# EasyEDA Pro project RackEth_rev_1.eprj

# Schematic RackEth
Board Name: RackEth; Create Date: 2024-12-09; Page Name: RackEth; Project Name: RackEth.pre_usb_fix; Schematic Name: RackEth; Update Date: 2025-01-19; Company: EasyEDA.com; Drawn: EasyEDA; Page Size: A4; Part Number: JLCPCB-002; Reviewed: EasyEDA; Version: V0.1
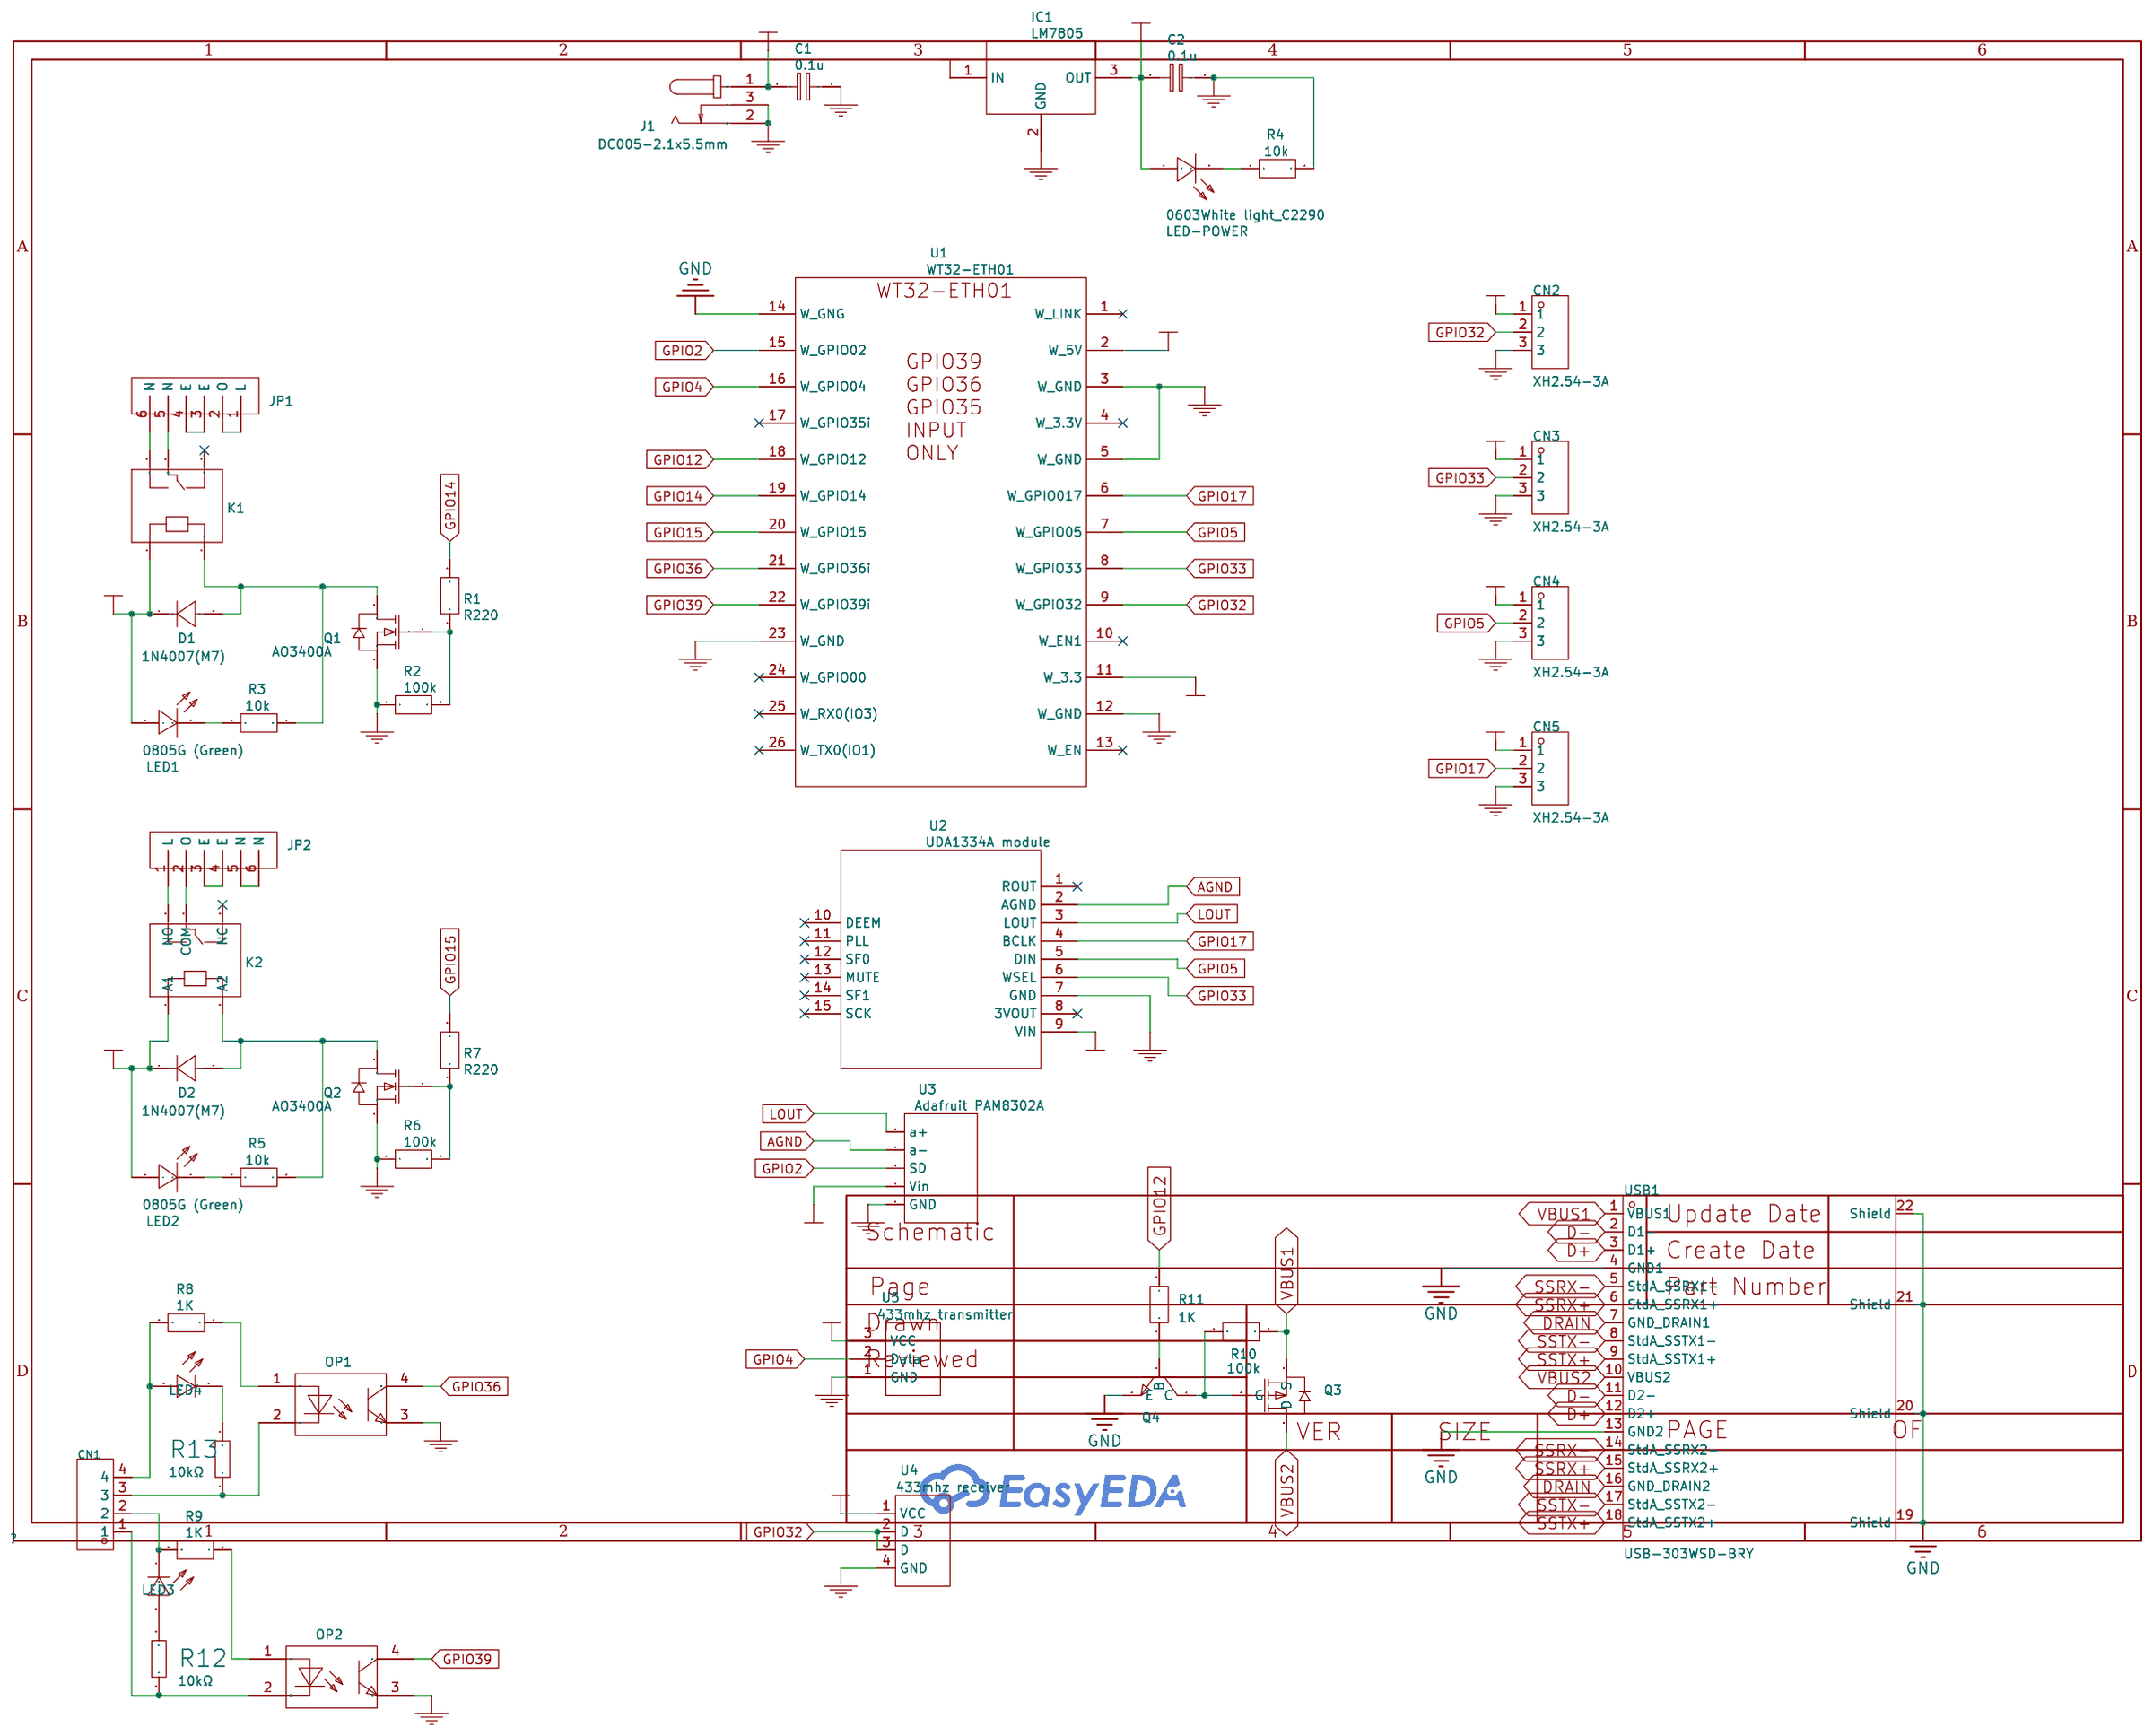
[diagram p0: schematic sheet]

## Parts
C1  0.1u  [C0603]
C2  0.1u  [C0603]
CN1  WJ127-5.0-4P  [CONN-TH_4P-P5.00_WJ127-5.0-4P]  (no BOM)
CN2  XH2.54-3A  [CONN-TH_3P-P2.50_HCTL_XH-3A-L]  (no BOM)
CN3  XH2.54-3A  [CONN-TH_3P-P2.50_HCTL_XH-3A-L]  (no BOM)
CN4  XH2.54-3A  [CONN-TH_3P-P2.50_HCTL_XH-3A-L]  (no BOM)
CN5  XH2.54-3A  [CONN-TH_3P-P2.50_HCTL_XH-3A-L]  (no BOM)
D1  1N4007(M7)  [SMA_L4.3-W2.7-LS5.1-RD]
D2  1N4007(M7)  [SMA_L4.3-W2.7-LS5.1-RD]
IC1  LM7805  [LM7805]  (no BOM)
J1  DC005-2.1x5.5mm  [DC-IN-TH_POWER-JACK]  (no BOM)
JP1  JP1  [CONN-TH_6P-P5.00_WJ127-5.0-6P]  (no BOM)
JP2  JP2  [CONN-TH_6P-P5.00_WJ127-5.0-6P]  (no BOM)
K1  Relay1  [SRD-05VDC-SL-C_RELAY_SRD-05VDC-SL-C]  (no BOM)
K2  Relay2  [SRD-05VDC-SL-C_RELAY_SRD-05VDC-SL-C]  (no BOM)
LED1  0805G (Green)  [LED0805-RD_GREEN]
LED2  0805G (Green)  [LED0805-RD_GREEN]
LED3  19-213/Y2C-CQ2R2L/3T(CY)  [LED0603-RD-YELLOW]
LED4  19-213/Y2C-CQ2R2L/3T(CY)  [LED0603-RD-YELLOW]
LED-POWER  0603White light_C2290  [LED0603-R-RD_WHITE]
OP1  EL817S1(C)(TU)-F  [OPTO-SMD-4_L4.6-W6.5-P2.54-LS10.3-TL]
OP2  EL817S1(C)(TU)-F  [OPTO-SMD-4_L4.6-W6.5-P2.54-LS10.3-TL]
Q1  AO3400A  [SOT-23-3_L2.9-W1.6-P1.90-LS2.8-BR]
Q2  AO3400A  [SOT-23-3_L2.9-W1.6-P1.90-LS2.8-BR]
Q3  AO3401A  [SOT-23_L2.9-W1.3-P1.90-LS2.4-BR]
Q4  MMBT3904(RANGE:100-300)  [SOT-23-3_L2.9-W1.3-P1.90-LS2.4-BR]
R1  R220  [R0603]
R2  100k  [R0603]
R3  10k  [R0603]
R4  10k  [R0603]
R5  10k  [R0603]
R6  100k  [R0603]
R7  R220  [R0603]
R8  1K  [R0603]
R9  1K  [R0603]
R10  100k  [R0603]
R11  1K  [R0603]
R12  10kΩ  [R0603]
R13  10kΩ  [R0603]
U1  WT32-ETH01  [WT32-ETH01-M]  (no BOM)
U2  UDA1334A module  [UDA1334A_MODULE]  (no BOM)
U3  Adafruit PAM8302A  [ADAFRUIT PAM8302A]  (no BOM)
U4  433mhz receiver  [433MHZ-RECEIVER-PINS]  (no BOM)
U5  433mhz transmitter  [RF-TRANSMITTER (433MHZ)]  (no BOM)
USB1  USB-303WSD-BRY  [USB-A-TH_XUNPU_USB-303WSD-BRY]  (no BOM)

## Library data of the parts
C1 C2 = 0.1u: Supplier Part: C1525; Supplier: LCSC; Manufacturer Part: CL05B104KO5NNNC; Manufacturer: SAMSUNG(三星)
CN1 = WJ127-5.0-4P: LCSC Part Name: 5mm 1x4P 排数:1 每排P数:4 直插; Supplier Part: C192779; Manufacturer: KANGNEX(康奈克斯电气); Supplier Footprint: 插件,P=5mm; JLCPCB Part Class: Extended Part; Datasheet: https://atta.szlcsc.com/upload/public/pdf/source/20191225/C192779_DBD79F61C9FABD31EC3EFBBD98D95251.pdf; Supplier: LCSC; Structure: 1x4P; Pitch: 5mm; Color: Green; Mounting Style: Straight; Current Rating (Max): 15A; Voltage Rating (Max): 250V; Number of Pins: 4P; Number of Rows: 1; Wire Gauge - AWG: 14~26; Wire Gauge - mm2: 1.5; Number of PINs Per Row: 4; Operating Temperature Range: -40℃~+105℃
CN2-CN5 = XH2.54-3A: Supplier Part: C9900018379; Supplier: LCSC
D1 D2 = 1N4007(M7): Supplier: LCSC; Supplier Part: C2988638; Manufacturer: UMW(友台半导体); JLCPCB Part Class: Extended Part
IC1 = LM7805: sim: true
J1 = DC005-2.1x5.5mm: Supplier: LCSC; Supplier Part: C9900001795; Manufacturer: 索峰; Manufacturer Part: POWER-JACK; JLCPCB Part Class: Extended Part
JP1 JP2 = Terminal?: Supplier Part: 6P Terminal Block Connector 5.0mm; Supplier: Amazon; link: https://www.amazon.com/gp/product/B00NWEC8TW
K1 = Relay1: Supplier Part: SRD-05VDC-SL-C_SRD-05VDC-SL-C
K2 = Relay2: Supplier Part: SRD-05VDC-SL-C_SRD-05VDC-SL-C
LED1 LED2 = 0805G (Green): Supplier: LCSC; Manufacturer: KENTO; Supplier Part: C2297; JLCPCB Part Class: Basic Part
LED3 LED4 = 19-213/Y2C-CQ2R2L/3T(CY): LCSC Part Name: 黄灯; Supplier Part: C72038; Manufacturer: EVERLIGHT(亿光); Supplier Footprint: 0603; JLCPCB Part Class: Basic Part; Datasheet: https://atta.szlcsc.com/upload/public/pdf/source/20160507/1462613613586.pdf; Supplier: LCSC; Emitted Color: Yellow; Power Dissipation: 60mW; Forward Current: 20mA; Dominant Wavelength: 585.5nm~591.5nm; Peak Wavelength: 591nm; Lens Color: 无色透明透镜; Viewing Angle: 120°; Operating Temperature: -40℃~+85℃
LED-POWER = 0603White light_C2290: Supplier: LCSC; Manufacturer: KENTO; Manufacturer Part: KT-0603W; Supplier Part: C2290; JLCPCB Part Class: Basic Part
OP1 OP2 = EL817S1(C)(TU)-F: Supplier: LCSC; Manufacturer: EVERLIGHT(亿光); Supplier Part: C106900; JLCPCB Part Class: Basic Part
Q1 Q2 = AO3400A: Supplier: LCSC; Manufacturer: AOS; Supplier Part: C20917; JLCPCB Part Class: Basic Part
Q3 = AO3401A_C15127: Type:1 Piece P-Channel Drain Source Voltage (Vdss): Continuous Drain Current (Id): Drain Source On Resistance (RDS(on)@Vgs,Id):44mΩ@10V,4.3A Power Dissipation (Pd): Gate Threshold Voltage (Vgs(th)@Id):1.3V@250uA Total Gate Charge (Qg@Vgs):12.2nC@4.5V Inpu; LCSC Part Name: 1个P沟道 耐压:30V 电流:4A; Supplier Part: C15127; Manufacturer: AOS; Supplier Footprint: SOT-23; JLCPCB Part Class: Basic Part; Datasheet: https://atta.szlcsc.com/upload/public/pdf/source/20160507/1462613609053.pdf; Supplier: LCSC; Type: 1 Piece P-Channel; Drain Source On Resistance (RDS(on)@Vgs,Id): 44mΩ@10V,4.3A; Gate Threshold Voltage (Vgs(th)@Id): 1.3V@250uA; Total Gate Charge (Qg@Vgs): 12.2nC@4.5V; Input Capacitance (Ciss@Vds): 1.2nF@15V; Operating Temperature: -55℃~+150℃@(Tj)
Q4 = MMBT3904(RANGE:100-300): Transistor Type: Collector Current (Ic): Collector-Emitter Breakdown Voltage (Vceo): Power Dissipation (Pd): DC Current Gain (hFE@Ic,Vce):100@10mA,1V DC Current Gain (hFE@Ic,Vce):100@10mA,1V Transition Frequency (fT):300MHz Collector Cut-Off Current (Icbo; LCSC Part Name: NPN 电流:200mA 耐压:40V hfe=100~300; Supplier Part: C20526; Manufacturer: CJ(江苏长电/长晶); Supplier Footprint: SOT-23; JLCPCB Part Class: Basic Part; Datasheet: https://atta.szlcsc.com/upload/public/pdf/source/20220704/70F575FB75061E03F919270A6BB8BA7F.pdf; Supplier: LCSC; DC Current Gain (hFE@Ic,Vce): 100@10mA,1V; Transition Frequency (fT): 300MHz; Collector Cut-Off Current (Icbo): 100nA; Collector-Emitter Saturation Voltage (VCE(sat)@Ic,Ib): 300mV@50mA,5mA
R1 R7 = R220: Supplier Part: C22962; Supplier: LCSC; Manufacturer Part: 0603WAF2200T5E; Manufacturer: UNI-ROYAL(厚声)
R2 R6 R10 = 100k: Supplier Part: C25803; Supplier: LCSC; Manufacturer Part: 0603WAF1003T5E; Manufacturer: UNI-ROYAL(厚声)
R3-R5 = 10k: Supplier Part: C25804; Supplier: LCSC; Manufacturer Part: 0603WAF1002T5E; Manufacturer: UNI-ROYAL(厚声)
R8 R9 R11 = 1K: Supplier Part: C22962; Supplier: LCSC; Manufacturer Part: 0603WAF2200T5E; Manufacturer: UNI-ROYAL(厚声)
R12 R13 = 0603WAF1002T5E: LCSC Part Name: 厚膜电阻 10kΩ ±1% 100mW; Supplier Part: C25804; Manufacturer: UNI-ROYAL(厚声); Supplier Footprint: 0603; JLCPCB Part Class: Basic Part; Datasheet: https://atta.szlcsc.com/upload/public/pdf/source/20200306/C422600_1E6D84923E4A46A82E41ADD87F860B5C.pdf; Supplier: LCSC; Type: Thick Film Resistors; Tolerance: ±1%; Temperature Coefficient: ±100ppm/℃; Operating Temperature Range: -55℃~+155℃
U1 = WT32-ETH01: Manufacturer: Wireless-Tag; link: http://www.wireless-tag.com/wp-content/uploads/2020/08/WT32-ETH01规格书V1.2EN（英文）.pdf
U2 = UDA1334A module
U3 = Adafruit PAM8302A
U4 = 433mhz receiver
U5 = 433mhz transmitter
USB1 = USB-303WSD-BRY: LCSC Part Name: Type-A 母 弯插; Supplier Part: C2895028; Manufacturer: XUNPU(讯普); Supplier Footprint: 插件; JLCPCB Part Class: Extended Part; Datasheet: https://atta.szlcsc.com/upload/public/pdf/source/20230426/A73C665BA3413059F595E5846F1512B5.pdf; Supplier: LCSC; Connector Type: Type-A; Standard: USB 3.0; Gender: Female; Mounting Style: Bend insert; Number of Contacts: 9Px2; Number of Ports: 2; Current Rating - Power (Max): 1.8A; Operating Temperature Range: -30℃~+85℃

## Nets
+3.3V: CN2.1 CN3.1 CN4.1 CN5.1 U1.11(W_3.3)
+5V: C2.1 D1.1(K) D2.1(K) IC1.3(OUT) K1.A1 K2.A1 LED1.2(A) LED2.2(A) LED-POWER.1(A) U1.2(W_5V) U2.9(VIN) U3.4(Vin) U4.1(VCC) U5.3(VCC)
AGND: U2.2(AGND) U3.2(a-)
GND: C1.2 C2.2 CN2.3 CN3.3 CN4.3 CN5.3 IC1.2(GND) J1.2(GND) J1.3 OP1.3(EM) OP2.3(EM) Q1.2(S) Q2.2(S) Q4.2(E) R2.1 R4.2 R6.1 U1.3(W_GND) U1.5(W_GND) U1.12(W_GND) U1.14(W_GNG) U1.23(W_GND) U2.7(GND) U3.5(GND) U4.4(GND) U5.1(GND) USB1.4(GND1) USB1.13(GND2) USB1.19(Shield) USB1.20(Shield) USB1.21(Shield) USB1.22(Shield)
VBUS1: Q3.2(S) R10.2 USB1.1(VBUS1)
VBUS2: Q3.3(D) USB1.10(VBUS2)
VCC: C1.1 IC1.1(IN) J1.1(VCC)
D+: USB1.3(D1+) USB1.12(D2+)
D-: USB1.2(D1-) USB1.11(D2-)
DRAIN: USB1.7(GND_DRAIN1) USB1.16(GND_DRAIN2)
GPIO2: U1.15(W_GPIO02) U3.3(SD)
GPIO4: U1.16(W_GPIO04) U5.2(Data)
GPIO5: CN4.2 U1.7(W_GPIO05) U2.5(DIN)
GPIO12: R11.2 U1.18(W_GPIO12)
GPIO14: R1.2 U1.19(W_GPIO14)
GPIO15: R7.2 U1.20(W_GPIO15)
GPIO17: CN5.2 U1.6(W_GPIO017) U2.4(BCLK)
GPIO32: CN2.2 U1.9(W_GPIO32) U4.2(D) U4.3(D)
GPIO33: CN3.2 U1.8(W_GPIO33) U2.6(WSEL)
GPIO36: OP1.4(COL) U1.21(W_GPIO36i)
GPIO39: OP2.4(COL) U1.22(W_GPIO39i)
LOUT: U2.3(LOUT) U3.1(a+)
SSRX+: USB1.6(StdA_SSRX1+) USB1.15(StdA_SSRX2+)
SSRX-: USB1.5(StdA_SSRX1-) USB1.14(StdA_SSRX2-)
SSTX+: USB1.9(StdA_SSTX1+) USB1.18(StdA_SSTX2+)
SSTX-: USB1.8(StdA_SSTX1-) USB1.17(StdA_SSTX2-)
$1N3: D1.2(A) K1.A2 Q1.3(D) R3.2
$1N5: Q1.1(G) R1.1 R2.2
$1N15: LED1.1(K) R3.1
$1N16: LED-POWER.2(K) R4.1
$1N18: D2.2(A) K2.A2 Q2.3(D) R5.2
$1N19: LED2.1(K) R5.1
$1N25: Q2.1(G) R6.2 R7.1
$1N58: OP1.1(AN) R8.1
$1N59: CN1.4 LED4.2(A) R8.2
$1N60: CN1.2 LED3.1(C) R9.2
$1N61: OP2.1(AN) R9.1
$1N4552: JP2.3(E) JP2.4(E)
$1N4588: JP1.6(N) K1.NO
$1N4592: JP1.5(N) K1.COM
$1N4597: JP1.3(E) JP1.4(E)
$1N4602: JP1.1(L) JP1.2(O)
$1N4658: JP2.2(O) K2.COM
$1N4661: JP2.1(L) K2.NO
$1N4663: JP2.5(N) JP2.6(N)
$1N8054: Q4.1(B) R11.1
$1N8058: Q3.1(G) Q4.3(C) R10.1
$1N12669: CN1.3 OP1.2(CAT) R13.1
$1N12679: CN1.1 OP2.2(CAT) R12.1
$1N14685: LED4.1(C) R13.2
$1N14687: LED3.2(A) R12.2

Not connected (* = marked no-connect by the designer): K1 NC*; K2 NC*; U1 1(W_LINK)* 4(W_3.3V)* 10(W_EN1)* 13(W_EN)* 17(W_GPIO35i)* 24(W_GPIO00)* 25(W_RX0(IO3))* 26(W_TX0(IO1))*; U2 1(ROUT)* 8(3VOUT)* 10(DEEM)* 11(PLL)* 12(SF0)* 13(MUTE)* 14(SF1)* 15(SCK)*

# Board RackEth
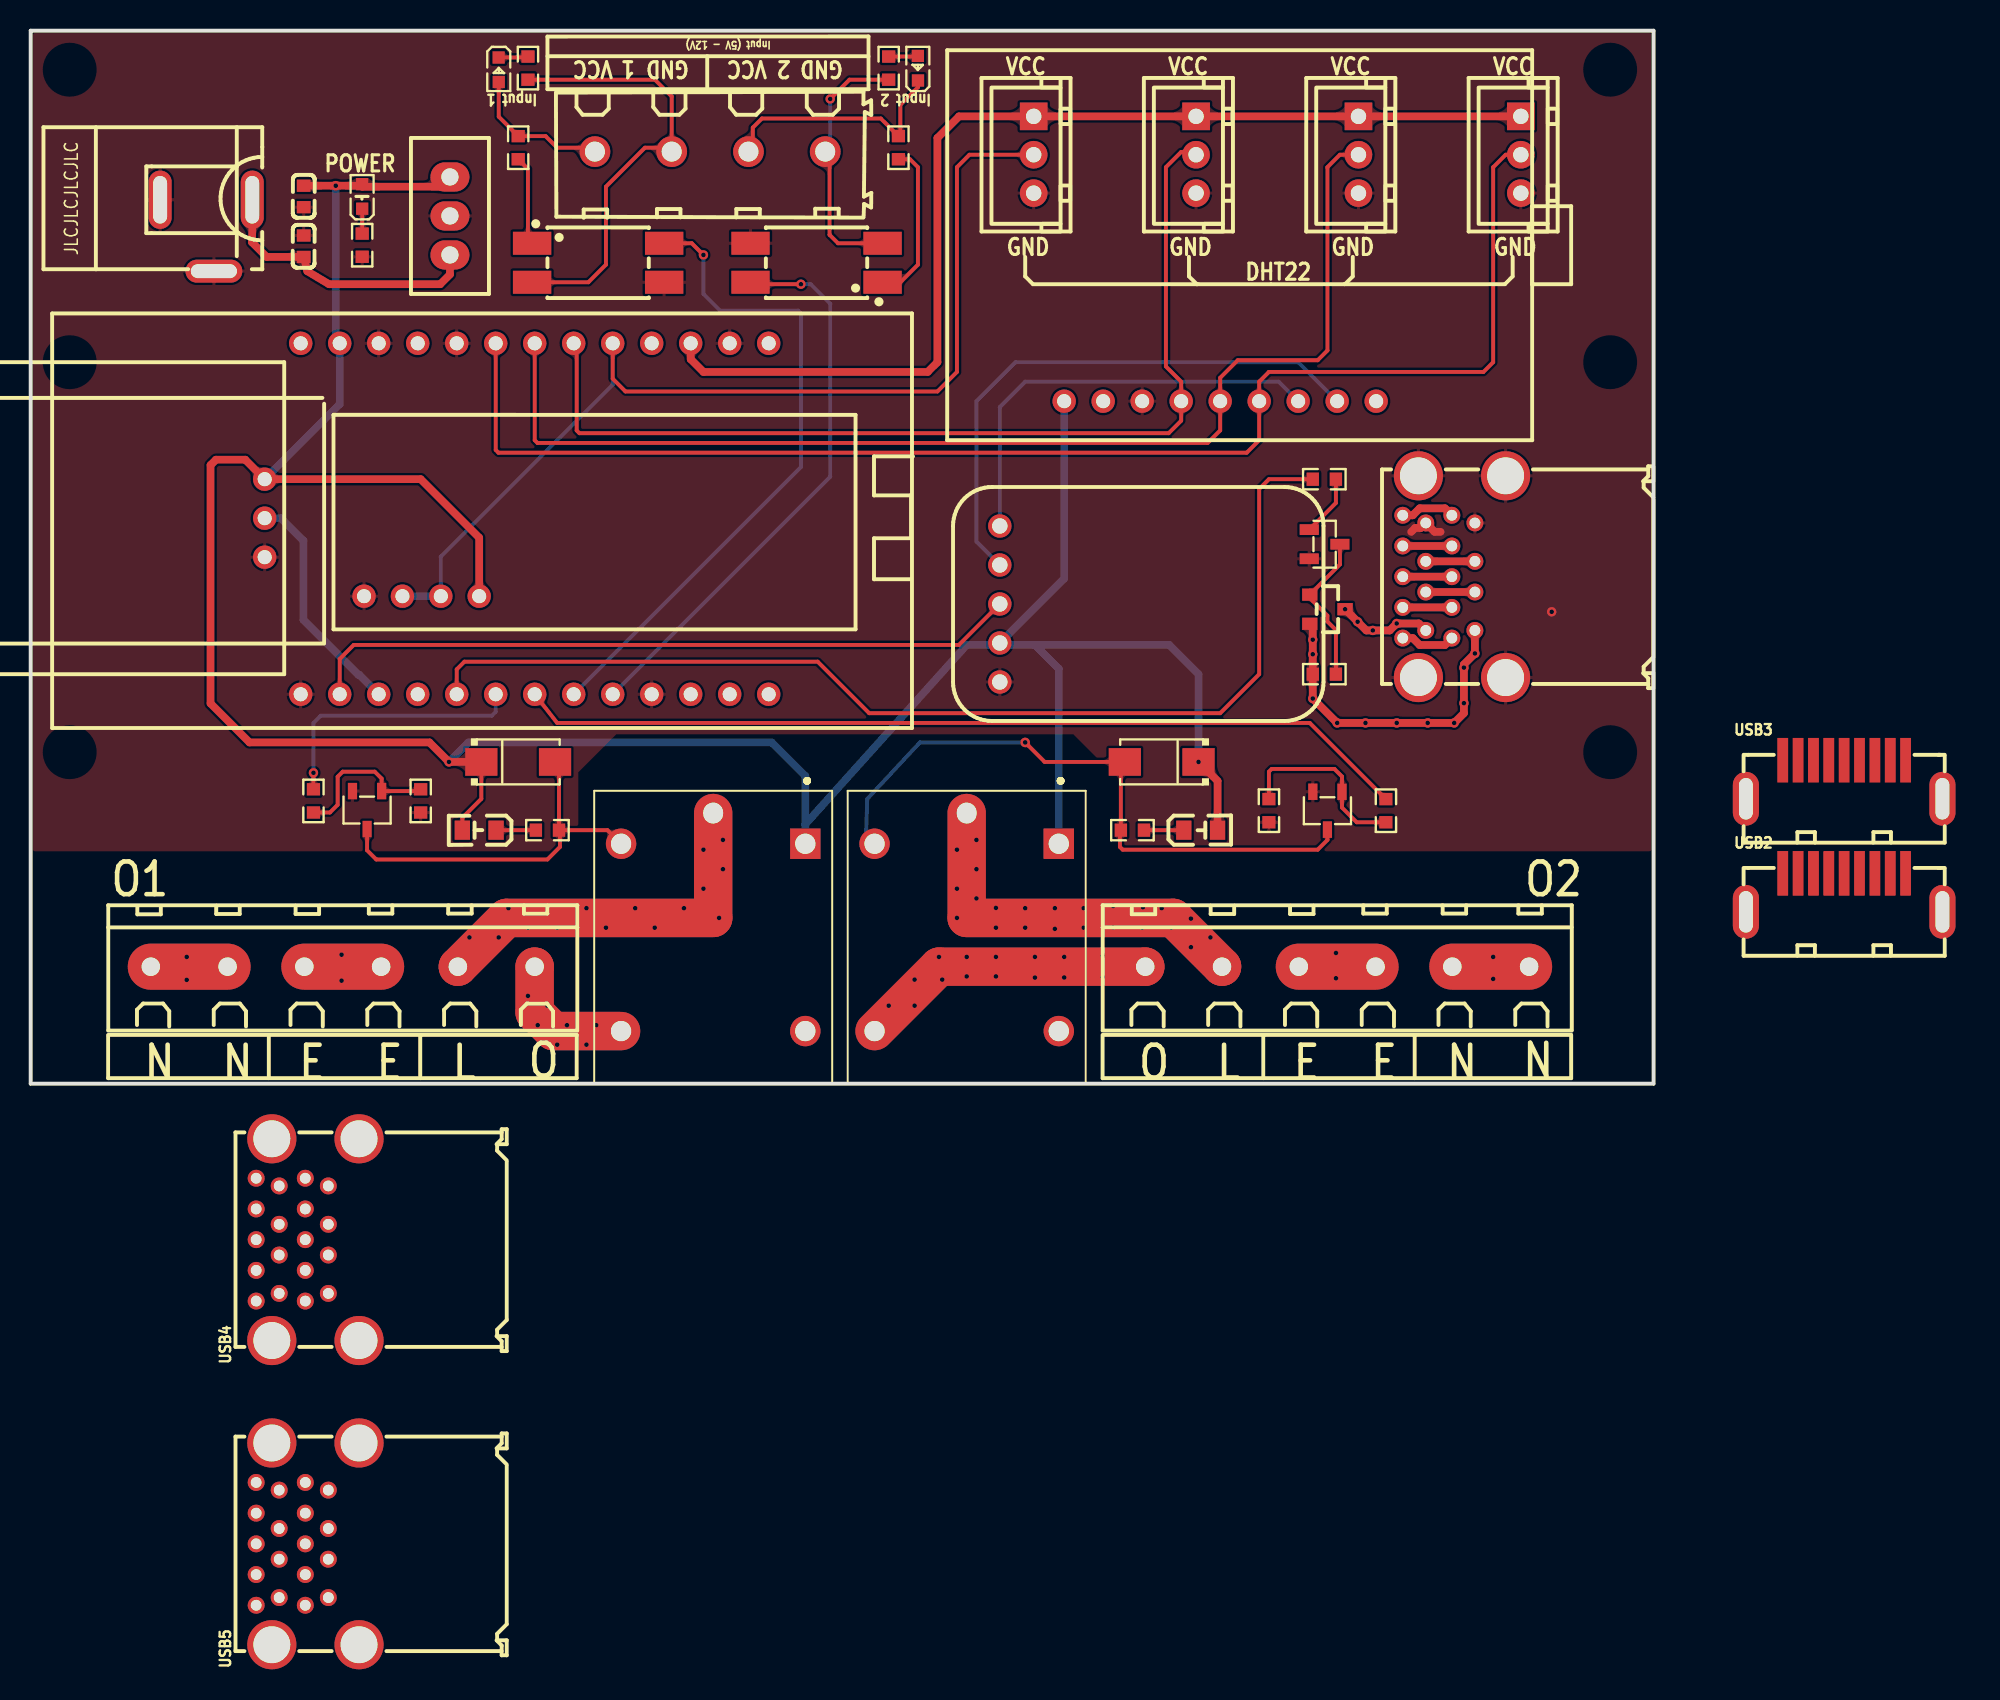
[diagram p1: board, top side]
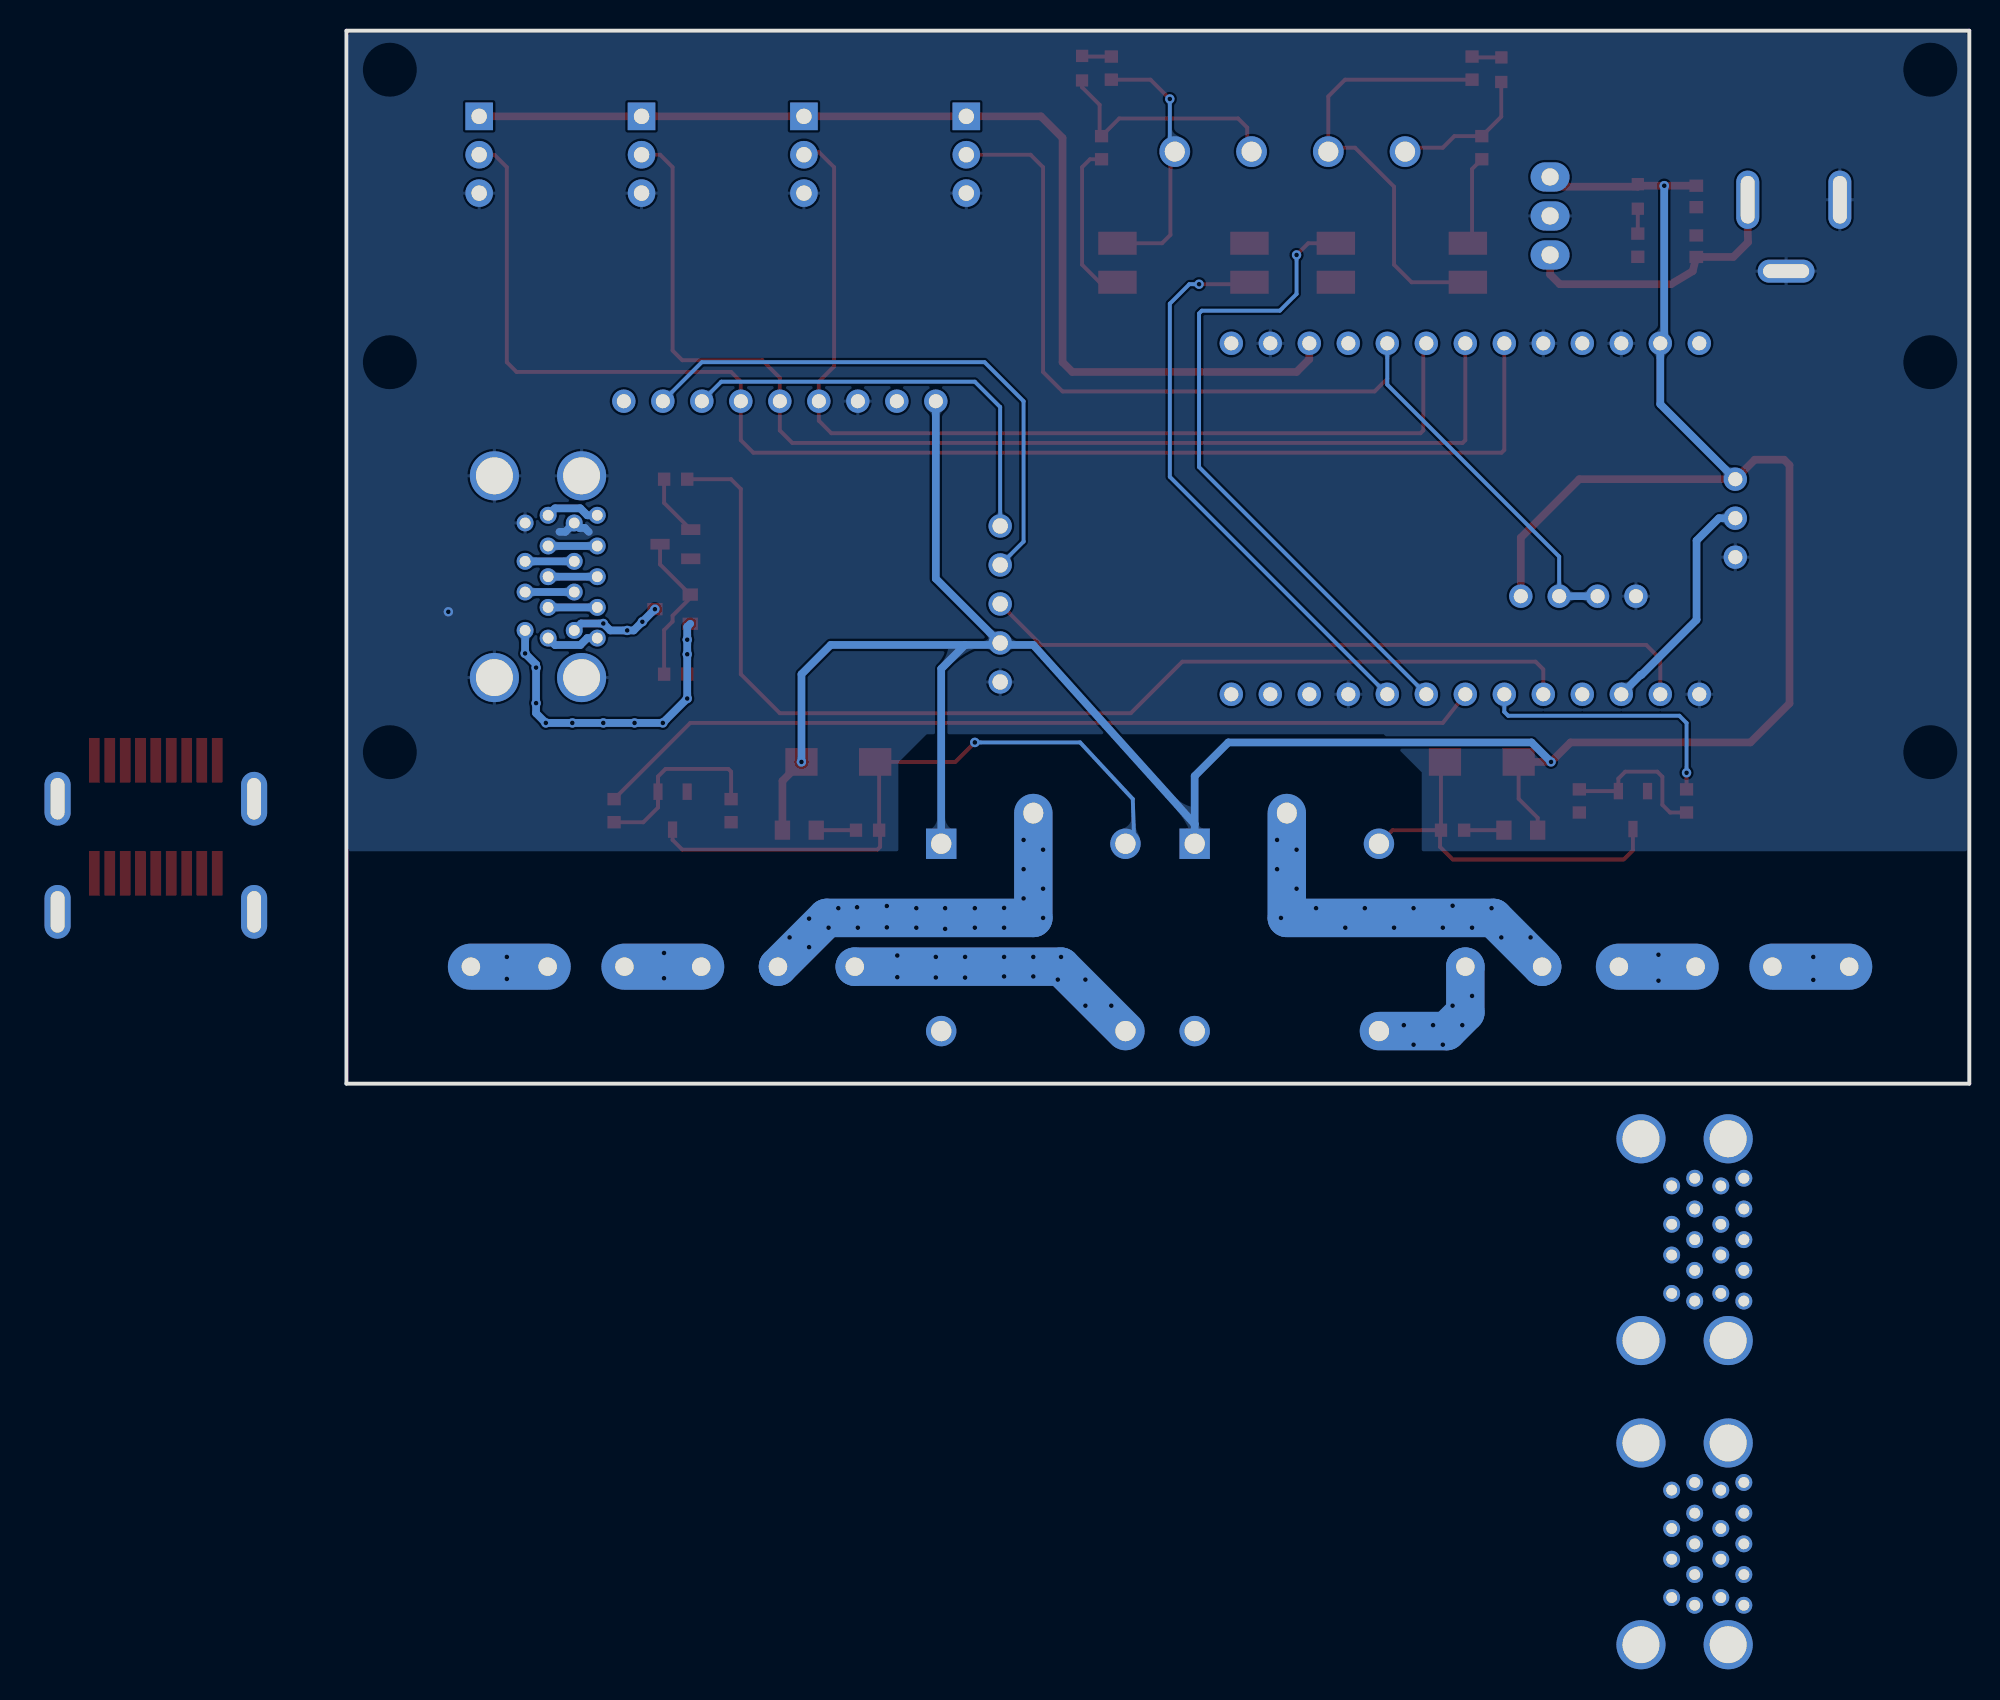
[diagram p2: board, bottom side, seen from below]

Outline 105.7 x 68.58 mm; copper layers: Top Layer, Bottom Layer. Coordinates in mm from the lower left corner of the outline.
Outline path: 0,68.58 105.7,68.58 105.7,0 0,0 0,68.58
Stack: Top Layer 0.035mm / Dielectric1 1.51mm FR4 er 4.5 / Bottom Layer 0.035mm

## Design rules (mm)
spacing Default (default): track to track 0.152, other pairs 0 to 0.152
track width Default (default): min 0.254, default 0.254, max 25.4
differential pair differentialPair (default): width min 0.127, default 0.254, max 2.54; gap min 0.152, default 0.152
via Default (default): diameter min 0.61, default 0.61, max 100.025; hole min 0.305, default 0.305, max 59.995
pour e157 uses gge16239
pour e214 uses gge16239(1)

## Placement (name value [footprint] x y rotation side)
C1  0.1u  [C0603]  17.78 54.55 90 top
C2  0.1u  [C0603]  17.78 57.78 270 top
CN1  WJ127-5.0-4P  [CONN-TH_4P-P5.00_WJ127-5.0-4P]  44.25 60.71 180 top
CN2  XH2.54-3A  [CONN-TH_3P-P2.50_HCTL_XH-3A-L]  65.32 60.5 90 top
CN3  XH2.54-3A  [CONN-TH_3P-P2.50_HCTL_XH-3A-L]  75.9 60.5 90 top
CN4  XH2.54-3A  [CONN-TH_3P-P2.50_HCTL_XH-3A-L]  86.48 60.5 90 top
CN5  XH2.54-3A  [CONN-TH_3P-P2.50_HCTL_XH-3A-L]  97.05 60.5 90 top
D1  1N4007(M7)  [SMA_L4.3-W2.7-LS5.1-RD]  31.75 20.95 0 top
D2  1N4007(M7)  [SMA_L4.3-W2.7-LS5.1-RD]  73.66 20.95 180 top
IC1  -  [LM7805]  27.31 56.52 90 top
J1  DC005-2.1x5.5mm  [DC-IN-TH_POWER-JACK]  11.43 55.25 0 top
JP1  JP1  [CONN-TH_6P-P5.00_WJ127-5.0-6P]  20.32 7.62 0 top
JP2  JP2  [CONN-TH_6P-P5.00_WJ127-5.0-6P]  85.09 7.62 0 top
K1  Relay1  [SRD-05VDC-SL-C_RELAY_SRD-05VDC-SL-C]  44.45 9.53 270 top
K2  Relay2  [SRD-05VDC-SL-C_RELAY_SRD-05VDC-SL-C]  60.96 9.53 270 top
LED1  0805G (Green)  [LED0805-RD_GREEN]  29.21 16.51 0 top
LED2  0805G (Green)  [LED0805-RD_GREEN]  76.2 16.51 180 top
LED3  19-213/Y2C-CQ2R2L/3T(CY)  [LED0603-RD-YELLOW]  57.78 66.14 90 top
LED4  19-213/Y2C-CQ2R2L/3T(CY)  [LED0603-RD-YELLOW]  30.48 66.04 270 top
LED-POWER  0603White light_C2290  [LED0603-R-RD_WHITE]  21.59 57.78 90 top
OP1  EL817S1(C)(TU)-F  [OPTO-SMD-4_L4.6-W6.5-P2.54-LS10.3-TL]  36.96 53.47 0 top
OP2  EL817S1(C)(TU)-F  [OPTO-SMD-4_L4.6-W6.5-P2.54-LS10.3-TL]  51.18 53.47 180 top
Q1  AO3400A  [SOT-23-3_L2.9-W1.6-P1.90-LS2.8-BR]  21.91 17.82 270 top
Q2  AO3400A  [SOT-23-3_L2.9-W1.6-P1.90-LS2.8-BR]  84.46 17.78 270 top
Q3  AO3401A  [SOT-23_L2.9-W1.3-P1.90-LS2.4-BR]  84.46 30.9 180 top
Q4  MMBT3904(RANGE:100-300)  [SOT-23-3_L2.9-W1.3-P1.90-LS2.4-BR]  84.27 35.14 180 top
R1  R220  [R0603]  18.42 18.42 90 top
R2  100k  [R0603]  25.4 18.42 90 top
R3  10k  [R0603]  33.66 16.51 0 top
R4  10k  [R0603]  21.59 54.61 270 top
R5  10k  [R0603]  71.75 16.51 180 top
R6  100k  [R0603]  80.65 17.78 90 top
R7  R220  [R0603]  88.26 17.78 90 top
R8  1K  [R0603]  31.75 60.96 90 top
R9  1K  [R0603]  56.51 60.96 90 top
R10  100k  [R0603]  84.25 26.67 180 top
R11  1K  [R0603]  84.25 39.37 180 top
R12  10kΩ  [R0603]  55.88 66.14 90 top
R13  10kΩ  [R0603]  32.38 66.14 90 top
U1  WT32-ETH01  [WT32-ETH01-M]  31.12 36.19 0 top
U2  UDA1334A module  [UDA1334A_MODULE]  80.01 54.61 0 top
U3  Adafruit PAM8302A  [ADAFRUIT PAM8302A]  73.66 25.4 0 top
U4  433mhz receiver  [433MHZ-RECEIVER-PINS]  29.21 35.56 180 top
U5  433mhz transmitter  [RF-TRANSMITTER (433MHZ)]  8.89 36.83 0 top
USB1  USB-303WSD-BRY  [USB-A-TH_XUNPU_USB-303WSD-BRY]  92.71 33.02 90 top
USB2  916-862A205EY10200  [USB3.0-A-SMD_916-862A205EY10200]  118.11 12.45 0 top
USB3  916-862A205EY10200  [USB3.0-A-SMD_916-862A205EY10200]  118.11 19.81 0 top
USB4  USB-303WSD-BRY  [USB-A-TH_XUNPU_USB-303WSD-BRY]  18.03 -10.16 90 top
USB5  USB-303WSD-BRY  [USB-A-TH_XUNPU_USB-303WSD-BRY]  18.03 -29.97 90 top

## Footprints (pads in the part's own frame, mm; a bottom-side part is the same pattern mirrored in y, then rotated)
433MHZ-RECEIVER-PINS
  round 1.524 hole 0.914: 1(0,3.81) 2(2.5,3.81) 3(5,3.81) 4(7.5,3.81)
ADAFRUIT PAM8302A
  round 1.524 hole 1x0.914: 1(-10.541,10.922) 2(-10.541,8.382) 3(-10.541,5.842) 4(-10.541,3.302) 5(-10.541,0.762)
C0603
  rect 0.8x0.9 smd: 1(-0.7,0) 2(0.7,0)
CONN-TH_3P-P2.50_HCTL_XH-3A-L
  rect 1.8x1.8 hole 1: 1(2.5,0)
  round 1.8 hole 1: 2(0,0) 3(-2.5,0)
CONN-TH_4P-P5.00_WJ127-5.0-4P
  round 2 hole 1.3: 1(-7.5,0) 2(-2.5,0) 3(2.5,0) 4(7.5,0)
CONN-TH_6P-P5.00_WJ127-5.0-6P
  round 2.5 hole 1.2: 1(-12.5,0) 2(-7.5,0) 3(-2.5,0) 4(2.5,0) 5(7.5,0) 6(12.5,0)
DC-IN-TH_POWER-JACK
  oval 1.5x3.8 hole 0.9x3.1: 1(3,2.325) 2(-2.999,2.325)
  oval 3.7x1.5 hole 3x0.9: 3(0.5,-2.325)
LED0603-R-RD_WHITE
  rect 0.8x0.8 smd: 1(0.8,0) 2(-0.8,0)
LED0603-RD-YELLOW
  rect 0.8x0.8 smd: 1(-0.799,-0.004) 2(0.799,0.004)
LED0805-RD_GREEN
  rect 1x1.25 smd: 1(1.1,0) 2(-1.099,0)
LM7805
  oval 1.905x2.54 hole 1.117: 1(-2.54,0) 2(0,0) 3(2.54,0)
OPTO-SMD-4_L4.6-W6.5-P2.54-LS10.3-TL
  rect 2.5x1.5 smd: 1(-4.3,1.27) 2(-4.3,-1.27) 3(4.3,-1.27) 4(4.3,1.27)
R0603
  rect 0.806x0.864 smd: 1(-0.753,0) 2(0.753,0)
RF-TRANSMITTER (433MHZ)
  round 1.524 hole 0.914: 1(6.35,-2.54) 2(6.35,0) 3(6.35,2.54)
SMA_L4.3-W2.7-LS5.1-RD
  rect 2.1x1.8 smd: 1(-2.4,0) 2(2.4,0)
SOT-23-3_L2.9-W1.3-P1.90-LS2.4-BR
  rect 1.25x0.7 smd: 1(1,-0.95) 2(1,0.95) 3(-1,0)
SOT-23-3_L2.9-W1.6-P1.90-LS2.8-BR
  rect 1.07x0.6 smd: 1(-1.235,0.95) 2(-1.235,-0.95) 3(1.236,0)
SOT-23_L2.9-W1.3-P1.90-LS2.4-BR
  rect 1x0.8 smd: 1(1.15,-0.95) 2(1.15,0.95) 3(-1.15,0)
SRD-05VDC-SL-C_RELAY_SRD-05VDC-SL-C
  rect 1.98x1.98 hole 1.32: A1(-6.1,6)
  round 1.98 hole 1.32: A2(-6.1,-6) NC(6.1,6) NO(6.1,-6)
  round 1.935 hole 1.355x1.29: COM(-8.1,0)
UDA1334A_MODULE
  round 1.524 hole 0.914: 1(7.62,-10.16) 2(5.08,-10.16) 3(2.54,-10.16) 4(0,-10.16) 5(-2.54,-10.16) 6(-5.08,-10.16) 7(-7.62,-10.16) 8(-10.16,-10.16) 9(-12.7,-10.16)
USB3.0-A-SMD_916-862A205EY10200
  rect 0.7x2.9 smd: 1(-3,1.255) 2(-1,1.255) 3(1,1.255) 4(3,1.255) 5(4,1.255) 6(2,1.255) 7(0,1.255) 8(-2,1.255) 9(-4,1.255)
  oval 1.7x3.5 hole 0.9x2.7: 10(-6.4,-1.255) 10(6.4,-1.255)
USB-A-TH_XUNPU_USB-303WSD-BRY
  round 1.1 hole 0.7: 1(-3.5,-1.35) 2(-1,-1.35) 3(1,-1.35) 4(3.5,-1.35) 5(4,0.15) 6(2,0.15) 7(0,0.15) 8(-2,0.15) 9(-4,0.15) 10(-3.5,1.85) 11(-1,1.85) 12(1,1.85) 13(3.5,1.85) 14(4,3.35) 15(2,3.35) 16(0,3.35) 17(-2,3.35) 18(-4,3.35)
  round 3.2 hole 2.4: 19(6.57,-3.35) 20(6.57,2.33) 21(-6.57,2.33) 22(-6.57,-3.35)
WT32-ETH01-M
  round 1.524 hole 0.914: 1(-13.529,12.027) 2(-10.989,12.027) 3(-8.449,12.027) 4(-5.909,12.027) 5(-3.369,12.027) 6(-0.829,12.027) 7(1.711,12.027) 8(4.251,12.027) 9(6.791,12.027) 10(9.331,12.027) 11(11.871,12.027) 12(14.411,12.027) 13(16.951,12.027) 14(-13.529,-10.833) 15(-10.989,-10.833) 16(-8.449,-10.833) 17(-5.909,-10.833) 18(-3.369,-10.833) 19(-0.829,-10.833) 20(1.711,-10.833) 21(4.251,-10.833) 22(6.791,-10.833) 23(9.331,-10.833) 24(11.871,-10.833) 25(14.411,-10.833) 26(16.951,-10.833)

## Nets
+3.3V: CN2.1 CN3.1 CN4.1 CN5.1 U1.11
+5V: C2.1 D1.1 D2.1 IC1.3 K1.A1 K2.A1 LED1.2 LED2.2 LED-POWER.1 U1.2 U2.9 U3.4 U4.1 U5.3
AGND: U2.2 U3.2
GND: C1.2 C2.2 CN2.3 CN3.3 CN4.3 CN5.3 IC1.2 J1.2 J1.3 OP1.3 OP2.3 Q1.2 Q2.2 Q4.2 R2.1 R4.2 R6.1 U1.3 U1.5 U1.12 U1.14 U1.23 U2.7 U3.5 U4.4 U5.1 USB1.4 USB1.13 USB1.19 USB1.20 USB1.21 USB1.22 USB2.4 USB2.10 USB3.4 USB3.10
VBUS1: Q3.2 R10.2 USB1.1
VBUS2: Q3.3 USB1.10
VCC: C1.1 IC1.1 J1.1
D+: USB1.3 USB1.12
D-: USB1.2 USB1.11
DRAIN: USB1.7 USB1.16
GPIO2: U1.15 U3.3
GPIO4: U1.16 U5.2
GPIO5: CN4.2 U1.7 U2.5
GPIO12: R11.2 U1.18
GPIO14: R1.2 U1.19
GPIO15: R7.2 U1.20
GPIO17: CN5.2 U1.6 U2.4
GPIO32: CN2.2 U1.9 U4.2 U4.3
GPIO33: CN3.2 U1.8 U2.6
GPIO36: OP1.4 U1.21
GPIO39: OP2.4 U1.22
LOUT: U2.3 U3.1
SSRX1+: USB4.9 USB5.6
SSRX1-: USB4.8 USB5.5
SSRX2+: USB4.18 USB5.15
SSRX2-: USB4.17 USB5.14
SSRX+: USB1.6 USB1.15
SSRX-: USB1.5 USB1.14
SSTX1+: USB4.6 USB5.9
SSTX1-: USB4.5 USB5.8
SSTX2+: USB4.15 USB5.18
SSTX2-: USB4.14 USB5.17
SSTX+: USB1.9 USB1.18
SSTX-: USB1.8 USB1.17
$1N3: D1.2 K1.A2 Q1.3 R3.2
$1N5: Q1.1 R1.1 R2.2
$1N15: LED1.1 R3.1
$1N16: LED-POWER.2 R4.1
$1N18: D2.2 K2.A2 Q2.3 R5.2
$1N19: LED2.1 R5.1
$1N25: Q2.1 R6.2 R7.1
$1N58: OP1.1 R8.1
$1N59: CN1.4 LED4.2 R8.2
$1N60: CN1.2 LED3.1 R9.2
$1N61: OP2.1 R9.1
$1N4552: JP2.3 JP2.4
$1N4588: JP1.6 K1.NO
$1N4592: JP1.5 K1.COM
$1N4597: JP1.3 JP1.4
$1N4602: JP1.1 JP1.2
$1N4658: JP2.2 K2.COM
$1N4661: JP2.1 K2.NO
$1N4663: JP2.5 JP2.6
$1N8054: Q4.1 R11.1
$1N8058: Q3.1 Q4.3 R10.1
$1N12669: CN1.3 OP1.2 R13.1
$1N12679: CN1.1 OP2.2 R12.1
$1N14685: LED4.1 R13.2
$1N14687: LED3.2 R12.2
$1N20666: USB2.1 USB3.1
$1N20668: USB2.2 USB3.2
$1N20670: USB2.3 USB3.3
$1N20674: USB2.5 USB3.5
$1N20676: USB2.6 USB3.6
$1N20678: USB2.7 USB3.7
$1N20680: USB2.8 USB3.8
$1N20682: USB2.9 USB3.9
$1N22210: USB4.1 USB5.1
$1N22214: USB4.2 USB5.2
$1N22219: USB4.3 USB5.3

Pads without a net: K1 NC; K2 NC; U1 1 4 10 13 17 24 25 26; U2 1 8; USB4 4 7 10 11 12 13 16 19 20 21 22; USB5 4 7 10 11 12 13 16 19 20 21 22

## Via types
v1: diameter 0.61, hole 0.305, Top Layer to Bottom Layer, 91 vias
v2: diameter 0.62, hole 0.31, Top Layer to Bottom Layer, 2 vias

## Routing (per net, layer and track width the routed paths; a pad name or vN(x,y) marks a point on that pad's centre or on a via; arc(x,y) is an arc through that point)
+3.3V: length 70.9
  Top Layer w0.5: CN5.1 CN4.1 CN3.1 CN2.1 60.46,63 59.06,61.59 59.06,46.99 58.42,46.36 43.81,46.36 42.99,47.18 U1.11
+5V: length 196.8
  Top Layer w0.254: LED1.2 28.11,17.31 29.35,18.56 D1.1
  Top Layer w0.5: D1.1 v1(27.24,20.95) 25.97,22.22 14.25,22.22 11.71,24.77 11.71,40.29 12.06,40.64 13.97,40.64 U5.3 25.4,39.37 29.21,35.56 U4.1 ; C2.1 v2(19.87,58.48) 21.49,58.48 LED-POWER.1 21.59,58.42 26.67,58.42 IC1.3 ; LED2.2 77.3,19.72 v1(76.06,20.95)
  Bottom Layer w0.5: v1(27.24,20.95) 28.51,22.22 48.26,22.22 50.45,20.03 50.45,16.89 ; 65.41,28.58 74.16,28.58 76.06,26.67 v1(76.06,20.95) ; 65.41,28.58 66.96,27.02 66.96,15.63 ; 65.41,28.58 63.25,28.58 ; 50.45,16.89 60.96,28.58 63.12,28.58 ; 50.45,16.89 K1.A1 ; U3.4 67.31,32.89 U2.9 ; U5.3 20.13,44.26 U1.2 19.87,48.48 v2(19.87,58.48)
AGND: length 36.9
  Bottom Layer w0.254: U2.2 82.55,46.99 64.13,46.99 61.59,44.45 61.59,35.31 U3.2
GND: length 4.8
  Top Layer w0.5: 91.82,35.94 91.44,35.94 USB1.13 90.53,36.19 90.17,36.19 89.92,35.94
  Bottom Layer w0.5: 91.82,35.94 91.44,35.94 USB1.13 90.53,36.19 90.17,36.19 89.92,35.94
VBUS1: length 42.8
  Top Layer w0.5: USB1.1 v1(94.06,28.02) 93.34,27.31 v1(93.34,24.78) 93.34,24.13 v1(92.71,23.5) v1(90.98,23.5) v1(88.97,23.5) v1(86.93,23.5) v1(85.09,23.5) v1(83.5,25.08) R10.2 v1(83.5,27.97) v1(83.5,28.92) 83.5,29.76 Q3.2
  Bottom Layer w0.5: USB1.1 v1(94.06,28.02) 93.34,27.31 v1(93.34,24.78) 93.34,24.13 v1(92.71,23.5) v1(90.98,23.5) v1(88.97,23.5) v1(86.93,23.5) v1(85.09,23.5) v1(83.5,25.08) v1(83.5,27.97) v1(83.5,28.92) 83.5,29.76 Q3.2
  vias: v1(93.34,27.1)
VBUS2: length 12.4
  Top Layer w0.5: USB1.10 90.41,29.97 v1(88.97,29.97) 88.51,29.52 v1(87.41,29.52) 86.99,29.52 v1(86.42,30.09) v1(85.6,30.9)
  Bottom Layer w0.5: USB1.10 90.41,29.97 v1(88.97,29.97) 88.51,29.52 v1(87.41,29.52) 86.99,29.52 v1(86.42,30.09) v1(85.6,30.9)
VCC: length 18.3
  Top Layer w0.5: 17.78,53.85 15.37,53.85 14.41,54.8 14.48,57.28 ; IC1.1 27.31,52.7 26.67,52.07 19.43,52.07 18.01,52.92 C1.1
(no net):
  vias: v1(99.06,30.73)
D+: length 6.4
  Top Layer w0.5: USB1.12 USB1.3
  Bottom Layer w0.5: USB1.12 USB1.3
D-: length 6.4
  Top Layer w0.5: USB1.11 USB1.2
  Bottom Layer w0.5: USB1.11 USB1.2
DRAIN: length 6.4
  Top Layer w0.5: USB1.16 USB1.7
  Bottom Layer w0.5: USB1.16 USB1.7
GPIO2: length 46.8
  Top Layer w0.254: U1.15 20.13,27.66 21.04,28.58 60.45,28.58 U3.3
GPIO4: length 15.2
  Bottom Layer w0.5: U1.16 21.4,26.63 21.34,26.63 17.76,30.21 17.76,35.37 16.3,36.83 U5.2
GPIO5: length 76.8
  Top Layer w0.254: CN4.2 85.27,60.5 84.46,59.69 84.46,47.75 83.82,47.12 78.61,47.12 77.47,45.97 U2.5 77.47,42.55 76.66,41.73 33.01,41.73 32.83,41.91 U1.7
GPIO12: length 72.4
  Top Layer w0.254: R11.2 80.64,39.37 80.01,38.73 80.01,26.67 77.47,24.13 54.61,24.13 51.26,27.48 28.25,27.48 27.75,26.98 U1.18
GPIO14: length 17.6
  Top Layer w0.254: v1(18.42,20.25) R1.2
  Bottom Layer w0.254: v1(18.42,20.25) 18.42,23.5 18.88,23.96 30.03,23.96 30.29,24.22 U1.19
GPIO15: length 58.4
  Top Layer w0.254: R7.2 83.3,23.5 34.29,23.5 32.83,25.36
GPIO17: length 91.5
  Top Layer w0.254: CN5.2 96.06,60.5 95.25,59.69 95.25,46.99 94.62,46.36 80.65,46.36 80.01,45.72 U2.4 80.01,41.91 79.19,41.1 30.47,41.1 30.29,41.28 U1.6
GPIO32: length 67.9
  Top Layer w0.254: U1.9 37.91,45.91 38.74,45.08 59.06,45.08 60.32,46.36 60.32,59.69 61.14,60.5 CN2.2
  Bottom Layer w0.254: U4.2 26.71,34.33 37.91,45.53 U1.9
  Bottom Layer w0.5: U4.2 U4.3
GPIO33: length 64.9
  Top Layer w0.254: U1.8 35.56,48.03 35.56,42.55 35.74,42.37 74.12,42.37 74.93,43.18 U2.6 74.93,45.72 73.94,46.71 73.94,59.69 74.93,60.68 75.72,60.68 CN3.2
GPIO36: length 43.2
  Top Layer w0.254: v1(43.81,53.97) 43.05,54.74 OP1.4
  Bottom Layer w0.254: v1(43.81,53.97) 43.81,51.44 44.91,50.34 49.99,50.34 50.16,50.17 50.16,40.16 U1.21
GPIO39: length 37.1
  Top Layer w0.254: OP2.4 47.01,52.07 v1(50.16,52.07)
  Bottom Layer w0.254: v1(50.16,52.07) 50.8,52.07 52.07,50.8 52.07,39.53 U1.22
LOUT: length 28.4
  Bottom Layer w0.254: U3.1 63.12,44.07 64.77,45.72 81.28,45.72 U2.3
SSRX+: length 6.4
  Top Layer w0.5: USB1.15 USB1.6
  Bottom Layer w0.5: USB1.15 USB1.6
SSRX-: length 7.1
  Top Layer w0.5: USB1.14 90.01,37.02 90.47,37.47 92.11,37.47 USB1.5
  Bottom Layer w0.5: USB1.14 90.01,37.02 90.47,37.47 92.11,37.47 USB1.5
SSTX+: length 7.1
  Top Layer w0.5: USB1.18 90.01,29.02 90.47,28.57 92.11,28.57 USB1.9
  Bottom Layer w0.5: USB1.9 92.11,28.57 90.47,28.57 90.01,29.02 USB1.18
SSTX-: length 6.4
  Top Layer w0.5: USB1.17 USB1.8
  Bottom Layer w0.5: USB1.17 USB1.8
$1N3: length 24.6
  Top Layer w0.254: K1.A2 37.56,16.51 R3.2 ; Q1.3 21.91,15.2 22.5,14.61 33.66,14.61 34.47,15.42 34.47,16.45 R3.2 ; R3.2 34.41,20.7 D1.2
$1N5: length 10.2
  Top Layer w0.254: R2.2 25.29,19.06 Q1.1 22.86,19.87 22.41,20.32 20.32,20.32 19.99,19.99 19.99,18.16 19.49,17.66 R1.1
$1N15: length 2.6
  Top Layer w0.254: LED1.1 R3.1
$1N16: length 1.6
  Top Layer w0.254: LED-POWER.2 R4.1
$1N18: length 42.2
  Top Layer w0.254: Q2.3 84.46,15.88 83.82,15.24 71.12,15.24 70.94,15.42 70.94,16.45 R5.2 71,20.7 D2.2 66.04,20.95 v2(64.77,22.22)
  Bottom Layer w0.254: K2.A2 54.41,16.22 54.48,18.54 57.91,22.22 v2(64.77,22.22)
$1N19: length 2.6
  Top Layer w0.254: R5.1 LED2.1
$1N25: length 12.1
  Top Layer w0.254: R6.2 80.65,20.32 80.82,20.5 84.91,20.5 85.4,20 Q2.1 85.4,17.98 86.36,17.03 R7.1
$1N58: length 5.8
  Top Layer w0.254: OP1.1 32.38,55.01 32.38,59.57 R8.1
$1N59: length 8.8
  Top Layer w0.254: LED4.2 30.48,62.98 31.75,61.71 33.54,61.71 34.29,60.96 36.24,60.96
$1N60: length 15.7
  Top Layer w0.254: LED3.1 57.79,64.9 56.64,63.75 56.64,61.84 56.51,61.71 55.36,62.86 47.62,62.86 47.03,62.27 47.03,60.96
$1N61: length 10.6
  Top Layer w0.254: 55.48,52.2 56.64,52.2 57.78,53.34 57.78,59.69 57.27,60.21 R9.1
$1N4552: length 10
  Top Layer w3: JP2.3 JP2.4
  Bottom Layer w3: JP2.3 JP2.4
  vias: v1(85.01,8.51) v1(85.01,6.87)
$1N4588: length 18.2
  Top Layer w2.5: JP1.6 32.82,4.64 34.04,3.43 K1.NO
  Bottom Layer w2.5: JP1.6 32.82,4.64 34.04,3.43 K1.NO
  vias: v1(32.38,5.72) v1(33.02,3.81) v1(33.66,5.08) v1(34.29,2.54) v1(34.93,3.81) v1(36.19,2.54) v1(36.83,3.81)
$1N4592: length 49.6
  Top Layer w2.5: 27.82,7.62 31,10.79 44.45,10.79 K1.COM
  Bottom Layer w2.5: 27.82,7.62 31,10.79 44.45,10.79 K1.COM
  vias: v1(28.57,9.53) v1(30.48,9.53) v1(31.12,11.43) v1(32.38,10.16) v1(33.65,11.59) v1(34.29,10.16) v1(36.19,11.43) v1(37.47,10.16) v1(39.37,11.43) v1(40.64,10.16) v1(42.54,11.43) v1(43.81,15.24) v1(43.81,12.7) v1(44.83,10.79) v1(45.09,15.88) v1(45.09,13.97)
$1N4597: length 10
  Top Layer w3: JP1.3 JP1.4
  Bottom Layer w3: JP1.3 JP1.4
  vias: v1(20.24,8.4) v1(20.24,6.71)
$1N4602: length 10
  Top Layer w3: JP1.1 JP1.2
  Bottom Layer w3: JP1.1 JP1.2
  vias: v1(10.16,8.25) v1(10.16,6.76)
$1N4658: length 49.5
  Top Layer w2.5: K2.COM 60.96,10.79 74.41,10.79 JP2.2
  Bottom Layer w2.5: JP2.2 74.41,10.79 60.96,10.79 K2.COM
  vias: v1(60.32,15.24) v1(60.32,12.7) v1(60.32,10.79) v1(61.59,15.88) v1(61.59,13.97) v1(61.59,12.06) v1(62.87,11.45) v1(62.87,10.16) v1(64.77,11.43) v1(64.77,10.16) v1(66.7,11.43) v1(66.7,10.08) v1(68.58,11.43) v1(68.58,10.16) v1(70.5,11.57) v1(70.5,10.18) v1(72.44,11.49) v1(72.39,10.16) v1(73.66,11.43) v1(74.29,10.16) v1(75.56,10.75) v1(75.56,8.89) v1(76.84,9.53)
$1N4661: length 38.7
  Top Layer w2.5: K2.NO 59.16,7.62 JP2.1
  Bottom Layer w2.5: K2.NO 59.16,7.62 JP2.1
  vias: v1(55.88,5.08) v1(57.57,6.78) v1(57.57,5.08) v1(59.16,8.25) v1(59.37,6.78) v1(60.96,8.25) v1(60.96,6.99) v1(62.87,8.25) v1(62.87,6.99) v1(65.41,8.25) v1(65.41,6.91) v1(67.31,8.25) v1(67.31,6.92) v1(69.82,8.35) v1(69.82,6.94)
$1N4663: length 10
  Top Layer w3: JP2.5 JP2.6
  Bottom Layer w3: JP2.5 JP2.6
  vias: v1(95.25,8.25) v1(95.25,6.82)
$1N8054: length 4
  Top Layer w0.254: R11.1 85.01,37.82 Q4.1
$1N8058: length 10
  Top Layer w0.254: Q4.3 85.27,33.82 Q3.1 83.31,31.63 84.46,30.48 84.46,30.1 85.01,29.55 R10.1
$1N12669: length 28.6
  Top Layer w0.254: R13.1 40.66,65.39 41.75,64.3 CN1.3 ; OP1.2 36.32,52.2 37.47,53.34 37.47,58.42 40,60.96 41.24,60.96
$1N12679: length 17.2
  Top Layer w0.254: 52.03,60.96 52.03,55.28 52.58,54.74 55.48,54.74 ; R12.1 53.32,65.39 v1(52.07,64.14)
  Bottom Layer w0.254: v1(52.07,64.14) 52.07,61.03 CN1.1
$1N14685: length 1.9
  Top Layer w0.254: LED4.1 32.33,66.84 R13.2
$1N14687: length 1.9
  Top Layer w0.254: LED3.2 57.74,66.9 R12.2

## Copper pours and planes (outline as drawn; the poured copper is in the pictures)
GND on Top Layer: 0,68.58 0,15.24 35.56,15.24 35.56,20.32 38.1,22.86 67.94,22.86 69.85,20.95 69.85,15.24 111.76,15.24 111.76,68.58
GND on Bottom Layer: 0,68.58 0,15.24 35.56,15.24 35.56,20.32 38.1,22.86 67.94,22.86 69.85,20.95 69.85,15.24 111.76,15.24 111.76,68.58

Small or netless copper shapes (teardrops, artwork), in the pictures only: 161 on Top Layer, 80 on Bottom Layer

## Text on the board
Top Silkscreen Layer: Input (5V - 12V) | Input 1 | Input 2 | JLCJLCJLCJLC | POWER | VCC | GND | DHT22 | 1 | 2 | O1 | N | E | L | O | O2
